# EAGLE design shed-lighting (EAGLE 7.1.0)
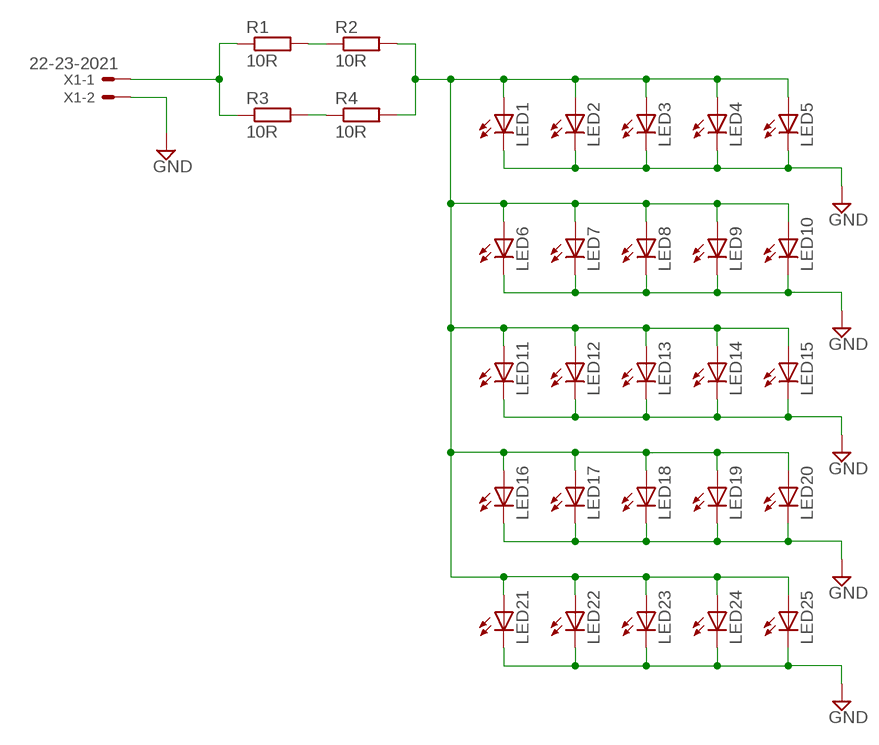
[diagram p0: schematic, sheet 1]

## Parts
LED1  LED10MM  [LED10MM]
LED2  LED10MM  [LED10MM]
LED3  LED10MM  [LED10MM]
LED4  LED10MM  [LED10MM]
LED5  LED10MM  [LED10MM]
LED6  LED10MM  [LED10MM]
LED7  LED10MM  [LED10MM]
LED8  LED10MM  [LED10MM]
LED9  LED10MM  [LED10MM]
LED10  LED10MM  [LED10MM]
LED11  LED10MM  [LED10MM]
LED12  LED10MM  [LED10MM]
LED13  LED10MM  [LED10MM]
LED14  LED10MM  [LED10MM]
LED15  LED10MM  [LED10MM]
LED16  LED10MM  [LED10MM]
LED17  LED10MM  [LED10MM]
LED18  LED10MM  [LED10MM]
LED19  LED10MM  [LED10MM]
LED20  LED10MM  [LED10MM]
LED21  LED10MM  [LED10MM]
LED22  LED10MM  [LED10MM]
LED23  LED10MM  [LED10MM]
LED24  LED10MM  [LED10MM]
LED25  LED10MM  [LED10MM]
R1  10R  R-EU_0207/10  [0207/10]
R2  10R  R-EU_0207/10  [0207/10]
R3  10R  R-EU_0207/10  [0207/10]
R4  10R  R-EU_0207/10  [0207/10]
X1  22-23-2021  [22-23-2021]

## Nets
GND: LED1.K(C) LED2.K(C) LED3.K(C) LED4.K(C) LED5.K(C) LED6.K(C) LED7.K(C) LED8.K(C) LED9.K(C) LED10.K(C) LED11.K(C) LED12.K(C) LED13.K(C) LED14.K(C) LED15.K(C) LED16.K(C) LED17.K(C) LED18.K(C) LED19.K(C) LED20.K(C) LED21.K(C) LED22.K(C) LED23.K(C) LED24.K(C) LED25.K(C) X1.2
N$1: R1.2 R2.1
N$2: R3.2 R4.1
N$4: LED1.A LED2.A LED3.A LED4.A LED5.A LED6.A LED7.A LED8.A LED9.A LED10.A LED11.A LED12.A LED13.A LED14.A LED15.A LED16.A LED17.A LED18.A LED19.A LED20.A LED21.A LED22.A LED23.A LED24.A LED25.A R2.2 R4.2
N$5: R1.1 R3.1 X1.1

## Library data of the parts
LED1-LED25 = led:LED: LED OSRAM: - CHIPLED LG R971, LG N971, LY N971, LG Q971, LY Q971, LO R971, LY R971 LH N974, LH R974 LS Q976, LO Q976, LY Q976 LO Q996 - Hyper CHIPLED LW Q18S LB Q993, LB Q99A, LB R99A - SideLED LS A670, LO A670, LY A670, LG A670, LP A670 LB A673, LV A673, LT A673, LW A673 LH A674 LY A675 LS A676, LA A676, LO A676, LY A676, LW A676 LS A679, LY A679, LG A679 - Hyper Micro SIDELED® LS Y876, LA Y876, LO Y876, LY Y876 LT Y87S - SmartLED LW L88C, LW L88S LB L89C, LB L89S, LG L890 LS L89K, LO L89K, LY L89K LS L896, LA L896, LO L896, LY L896 - TOPLED LS T670, LO T670, LY T670, LG T670, LP T670 LSG T670, LSP T670, LSY T670, LOP T670, LYG T670 LG T671, LOG T671, LSG T671 LB T673, LV T673, LT T673, LW T673 LH T674 LS T676, LA T676, LO T676, LY T676, LB T676, LH T676, LSB T676, LW T676 LB T67C, LV T67C, LT T67C, LS T67K, LO T67K, LY T67K, LW E67C LS E67B, LA E67B, LO E67B, LY E67B, LB E67C, LV E67C, LT E67C LW T67C LS T679, LY T679, LG T679 LS T770, LO T770, LY T770, LG T770, LP T770 LB T773, LV T773, LT T773, LW T773 LH T774 LS E675, LA E675, LY E675, LS T675 LS T776, LA T776, LO T776, LY T776, LB T776 LHGB T686 LT T68C, LB T68C - Hyper Mini TOPLED® LB M676 - Mini TOPLED Santana® LG M470 LS M47K, LO M47K, LY M47K Source: http://www.osram.convergy.de LUXEON: - LUMILED® LXK2-PW12-R00, LXK2-PW12-S00, LXK2-PW14-U00, LXK2-PW14-V00 LXK2-PM12-R00, LXK2-PM12-S00, LXK2-PM14-U00 LXK2-PE12-Q00, LXK2-PE12-R00, LXK2-PE12-S00, LXK2-PE14-T00, LXK2-PE14-U00 LXK2-PB12-K00, LXK2-PB12-L00, LXK2-PB12-M00, LXK2-PB14-N00, LXK2-PB14-P00, LXK2-PB14-Q00 LXK2-PR12-L00, LXK2-PR12-M00, LXK2-PR14-Q00, LXK2-PR14-R00 LXK2-PD12-Q00, LXK2-PD12-R00, LXK2-PD12-S00 LXK2-PH12-R00, LXK2-PH12-S00 LXK2-PL12-P00, LXK2-PL12-Q00, LXK2-PL12-R00 Source: www.luxeon.com KINGBRIGHT: KA-3528ASYC Source: www.kingbright.com
R1-R4 = rcl:R-EU_: RESISTOR, European symbol
X1 = con-molex:22-23-2021: .100" (2.54mm) Center Header - 2 Pin; MF: MOLEX; MPN: 22-23-2021; OC_FARNELL: 1462926; OC_NEWARK: 25C3832

## Board
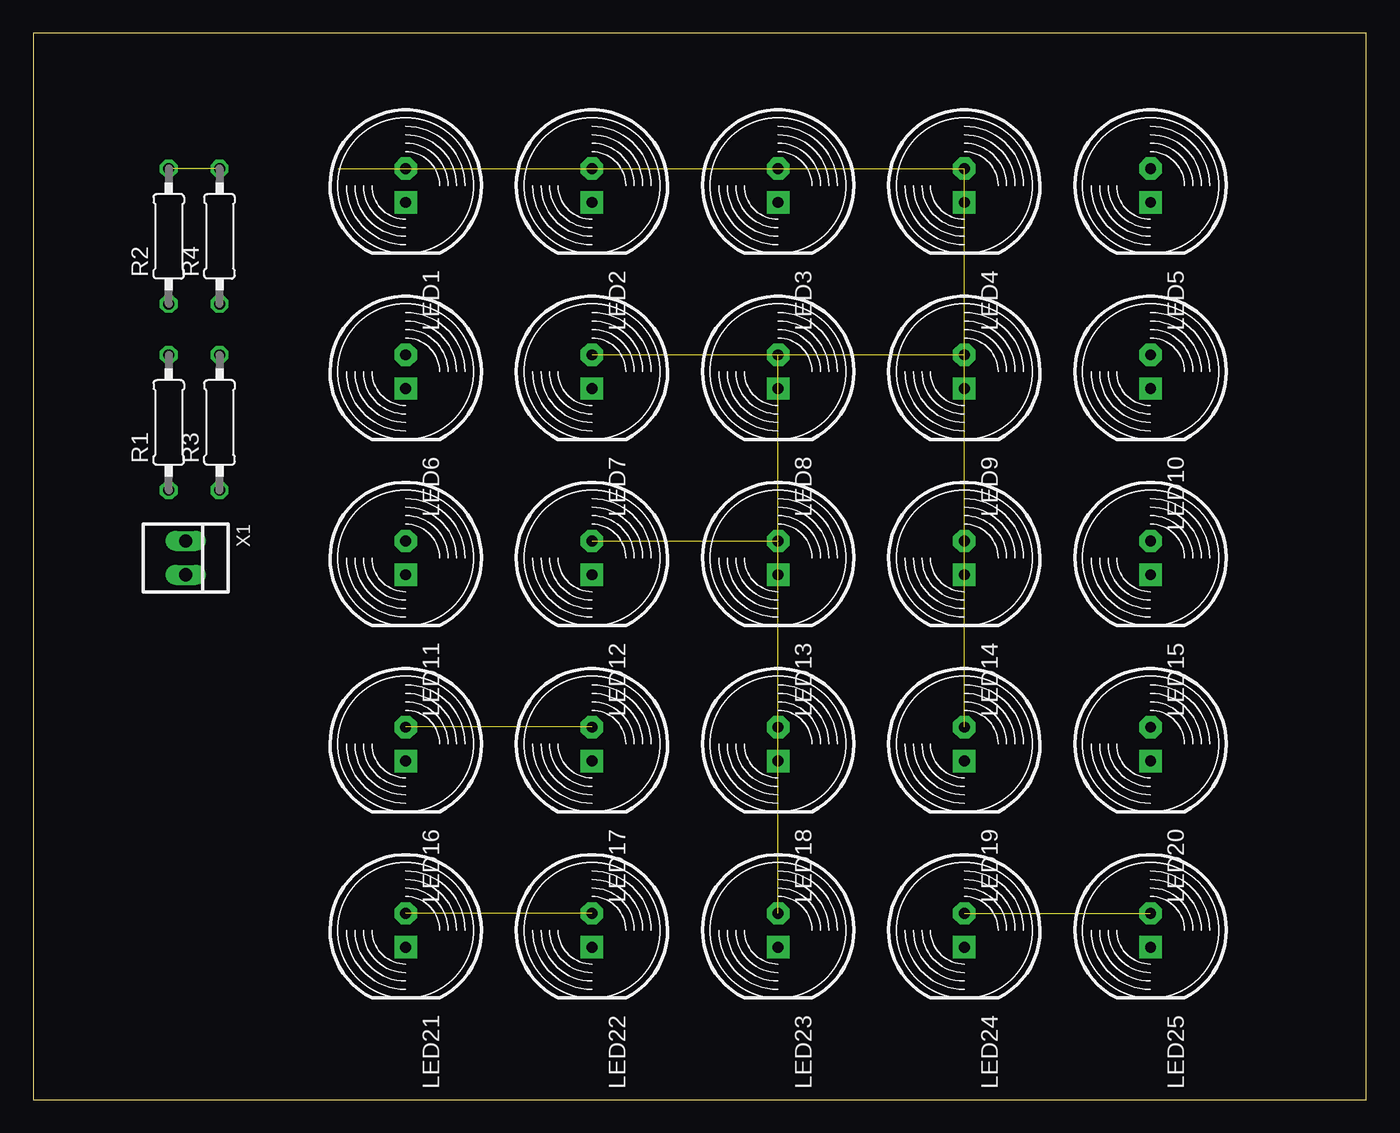
[diagram p1: board, top side]
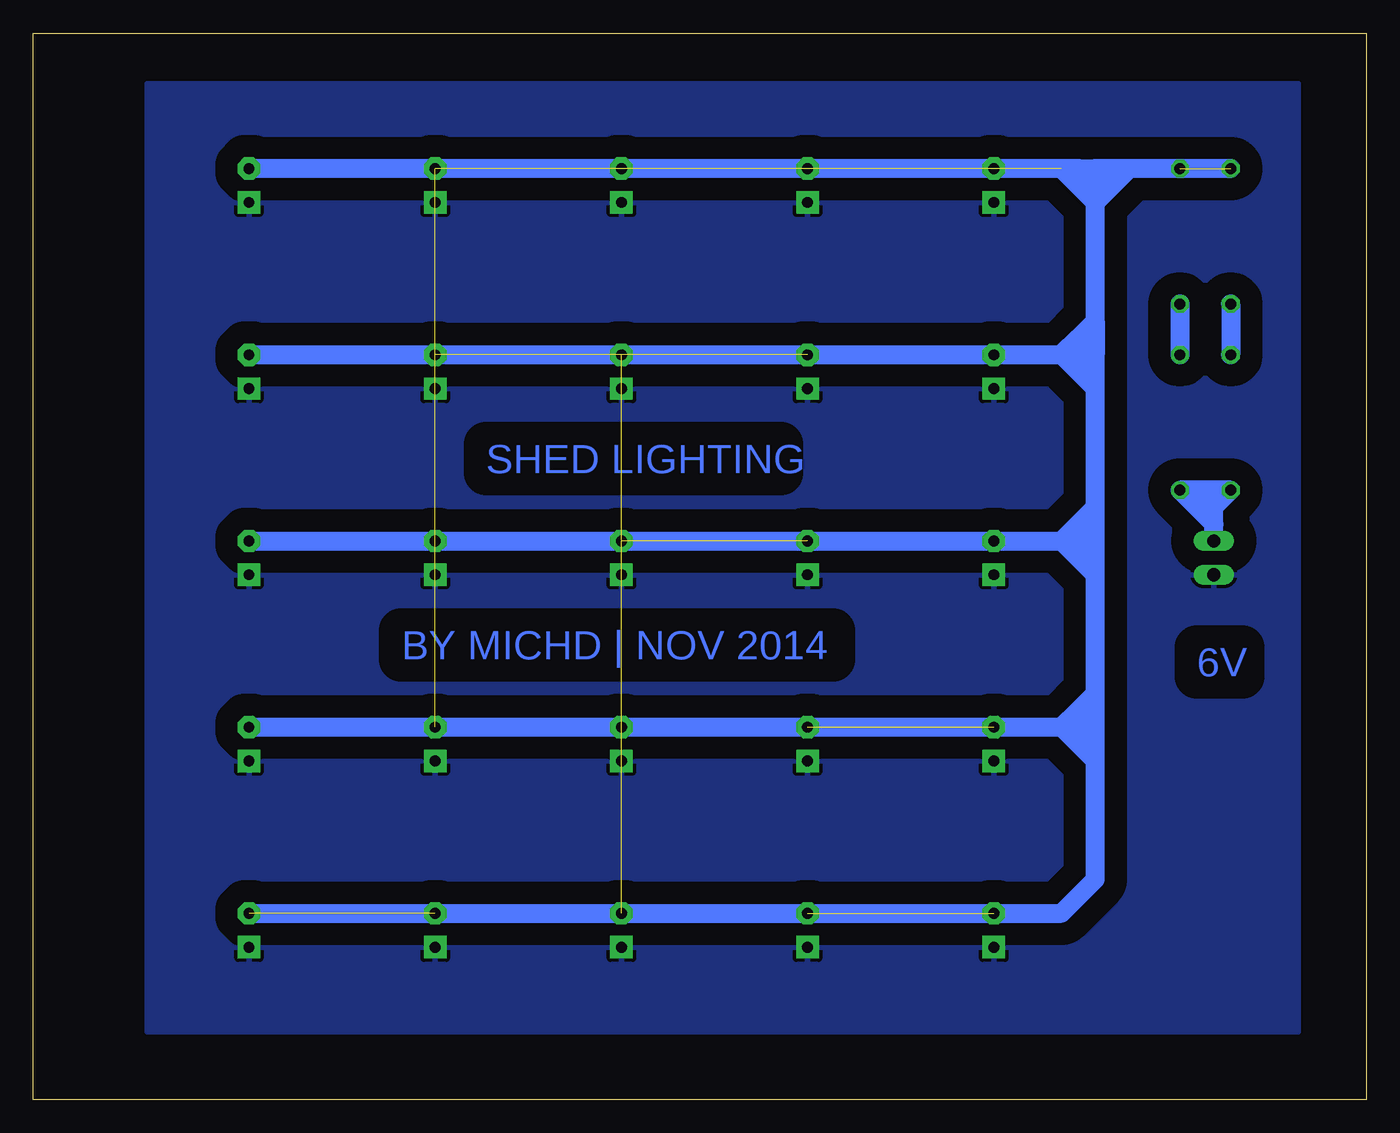
[diagram p2: board, bottom side, seen from below]

Size 100 x 80 mm. Coordinates in mm from the lower left corner, seen from the top.
Outline: 0,0 100,0 100,80 0,80 0,0
Copper layers (1*16): Top 0.035mm / dielectric 1.5mm / Bottom 0.035mm
Design rules "default": minimum track width 10mil, minimum drill 24mil, track to track 8mil, track to pad 8mil, pad to pad 8mil, via to via 8mil, smd to smd 8mil, copper to edge 40mil, drill to drill 8mil, minimum pad ring 10mil, minimum via ring 8mil, stop-mask expansion 4mil, vias tented up to drill 0mil, thermal gap 10mil

### Footprints (pad centres in the part's own frame; a part is rotated, then mirrored left to right if it is on the bottom)
LED10MM = drill 0.813 pad 1.676 octagon: A -1.27,0 | drill 0.813 pad 1.676 square: K 1.27,0
0207/10 = drill 0.813 octagon: 1 -5.08,0; 2 5.08,0
22-23-2021 = drill 1 long: 1 -1.27,0; 2 1.27,0

### Placement (x,y rotation side)
LED1  27.94,68.58 270 top
LED2  41.91,68.58 270 top
LED3  55.88,68.58 270 top
LED4  69.85,68.58 270 top
LED5  83.82,68.58 270 top
LED6  27.94,54.61 270 top
LED7  41.91,54.61 270 top
LED8  55.88,54.61 270 top
LED9  69.85,54.61 270 top
LED10  83.82,54.61 270 top
LED11  27.94,40.64 270 top
LED12  41.91,40.64 270 top
LED13  55.88,40.64 270 top
LED14  69.85,40.64 270 top
LED15  83.82,40.64 270 top
LED16  27.94,26.67 270 top
LED17  41.91,26.67 270 top
LED18  55.88,26.67 270 top
LED19  69.85,26.67 270 top
LED20  83.82,26.67 270 top
LED21  27.94,12.7 270 top
LED22  41.91,12.7 270 top
LED23  55.88,12.7 270 top
LED24  69.85,12.7 270 top
LED25  83.82,12.7 270 top
R1  10.16,50.8 90 top
R2  10.16,64.77 90 top
R3  13.97,50.8 90 top
R4  13.97,64.77 90 top
X1  11.43,40.64 270 top

### Tracks (layer width: path | path; a pad name or v marks a point on that pad's centre or on a via)
GND
  pour Bottom (isolate 1.676): 91.44,5.08 91.44,76.2 5.08,76.2 5.08,5.08
N$1
  Bottom 1.422: R2.1 R1.2
N$2
  Bottom 1.422: R4.1 R3.2
N$4  (17 unrouted)
  Bottom 1.422: R2.2 17.78,69.85 | 22.86,69.85 LED5.A | LED10.A LED6.A 22.86,55.88 | LED15.A LED11.A 22.86,41.91 | LED20.A LED16.A 22.86,27.94 | LED25.A LED21.A 22.86,13.97 20.32,16.51 20.32,25.4 | 20.32,58.42 20.32,67.31 | 20.32,67.31 17.78,69.85 | 17.78,69.85 19.05,69.85 | 19.05,69.85 20.32,69.85 | 21.59,69.85 22.86,69.85 | 22.86,69.85 21.59,68.58 | 21.59,68.58 20.32,67.31 | 20.32,67.31 20.32,68.58 | 20.32,68.58 20.32,69.85 | 20.32,25.4 20.32,27.94 | 20.32,27.94 20.32,30.48 | 20.32,30.48 20.32,39.37 | 20.32,39.37 20.32,41.91 | 20.32,41.91 20.32,44.45 | 20.32,44.45 20.32,53.34 | 20.32,53.34 20.32,55.88 | 20.32,58.42 21.59,57.15 | 21.59,57.15 22.86,55.88 | 22.86,55.88 21.59,54.61 | 21.59,54.61 20.32,53.34 | 22.86,41.91 21.59,43.18 | 21.59,43.18 20.32,44.45 | 22.86,27.94 21.59,29.21 | 21.59,29.21 20.32,30.48 | 22.86,41.91 21.59,40.64 | 21.59,40.64 20.32,39.37 | 22.86,27.94 21.59,26.67 | 21.59,26.67 20.32,25.4 | 22.86,55.88 20.32,55.88 | 22.86,41.91 20.32,41.91 | 22.86,27.94 20.32,27.94 | 20.32,58.42 20.32,55.88 | 20.32,55.88 21.59,54.61 | 21.59,54.61 21.59,57.15 | 21.59,43.18 20.32,41.91 | 20.32,41.91 21.59,40.64 | 21.59,68.58 20.32,68.58 | 20.32,68.58 21.59,69.85 | 21.59,69.85 20.32,69.85 | 19.05,69.85 20.32,68.58 | 21.59,29.21 20.32,27.94 | 20.32,27.94 21.59,26.67
N$5
  Bottom 1.422: X1.1 11.43,43.18 | 11.43,43.18 12.7,44.45 | 12.7,44.45 R3.1 12.7,45.72 | 11.43,43.18 11.43,44.45 | 11.43,44.45 R1.1 11.43,45.72 | 11.43,45.72 12.7,45.72 | 12.7,44.45 12.7,45.72 | 11.43,44.45 11.43,45.72

### Text on the board
Bottom: SHED LIGHTING | BY MICHD | NOV 2014 | 6V